# EAGLE schematic board_rev3 (EAGLE 4.16)
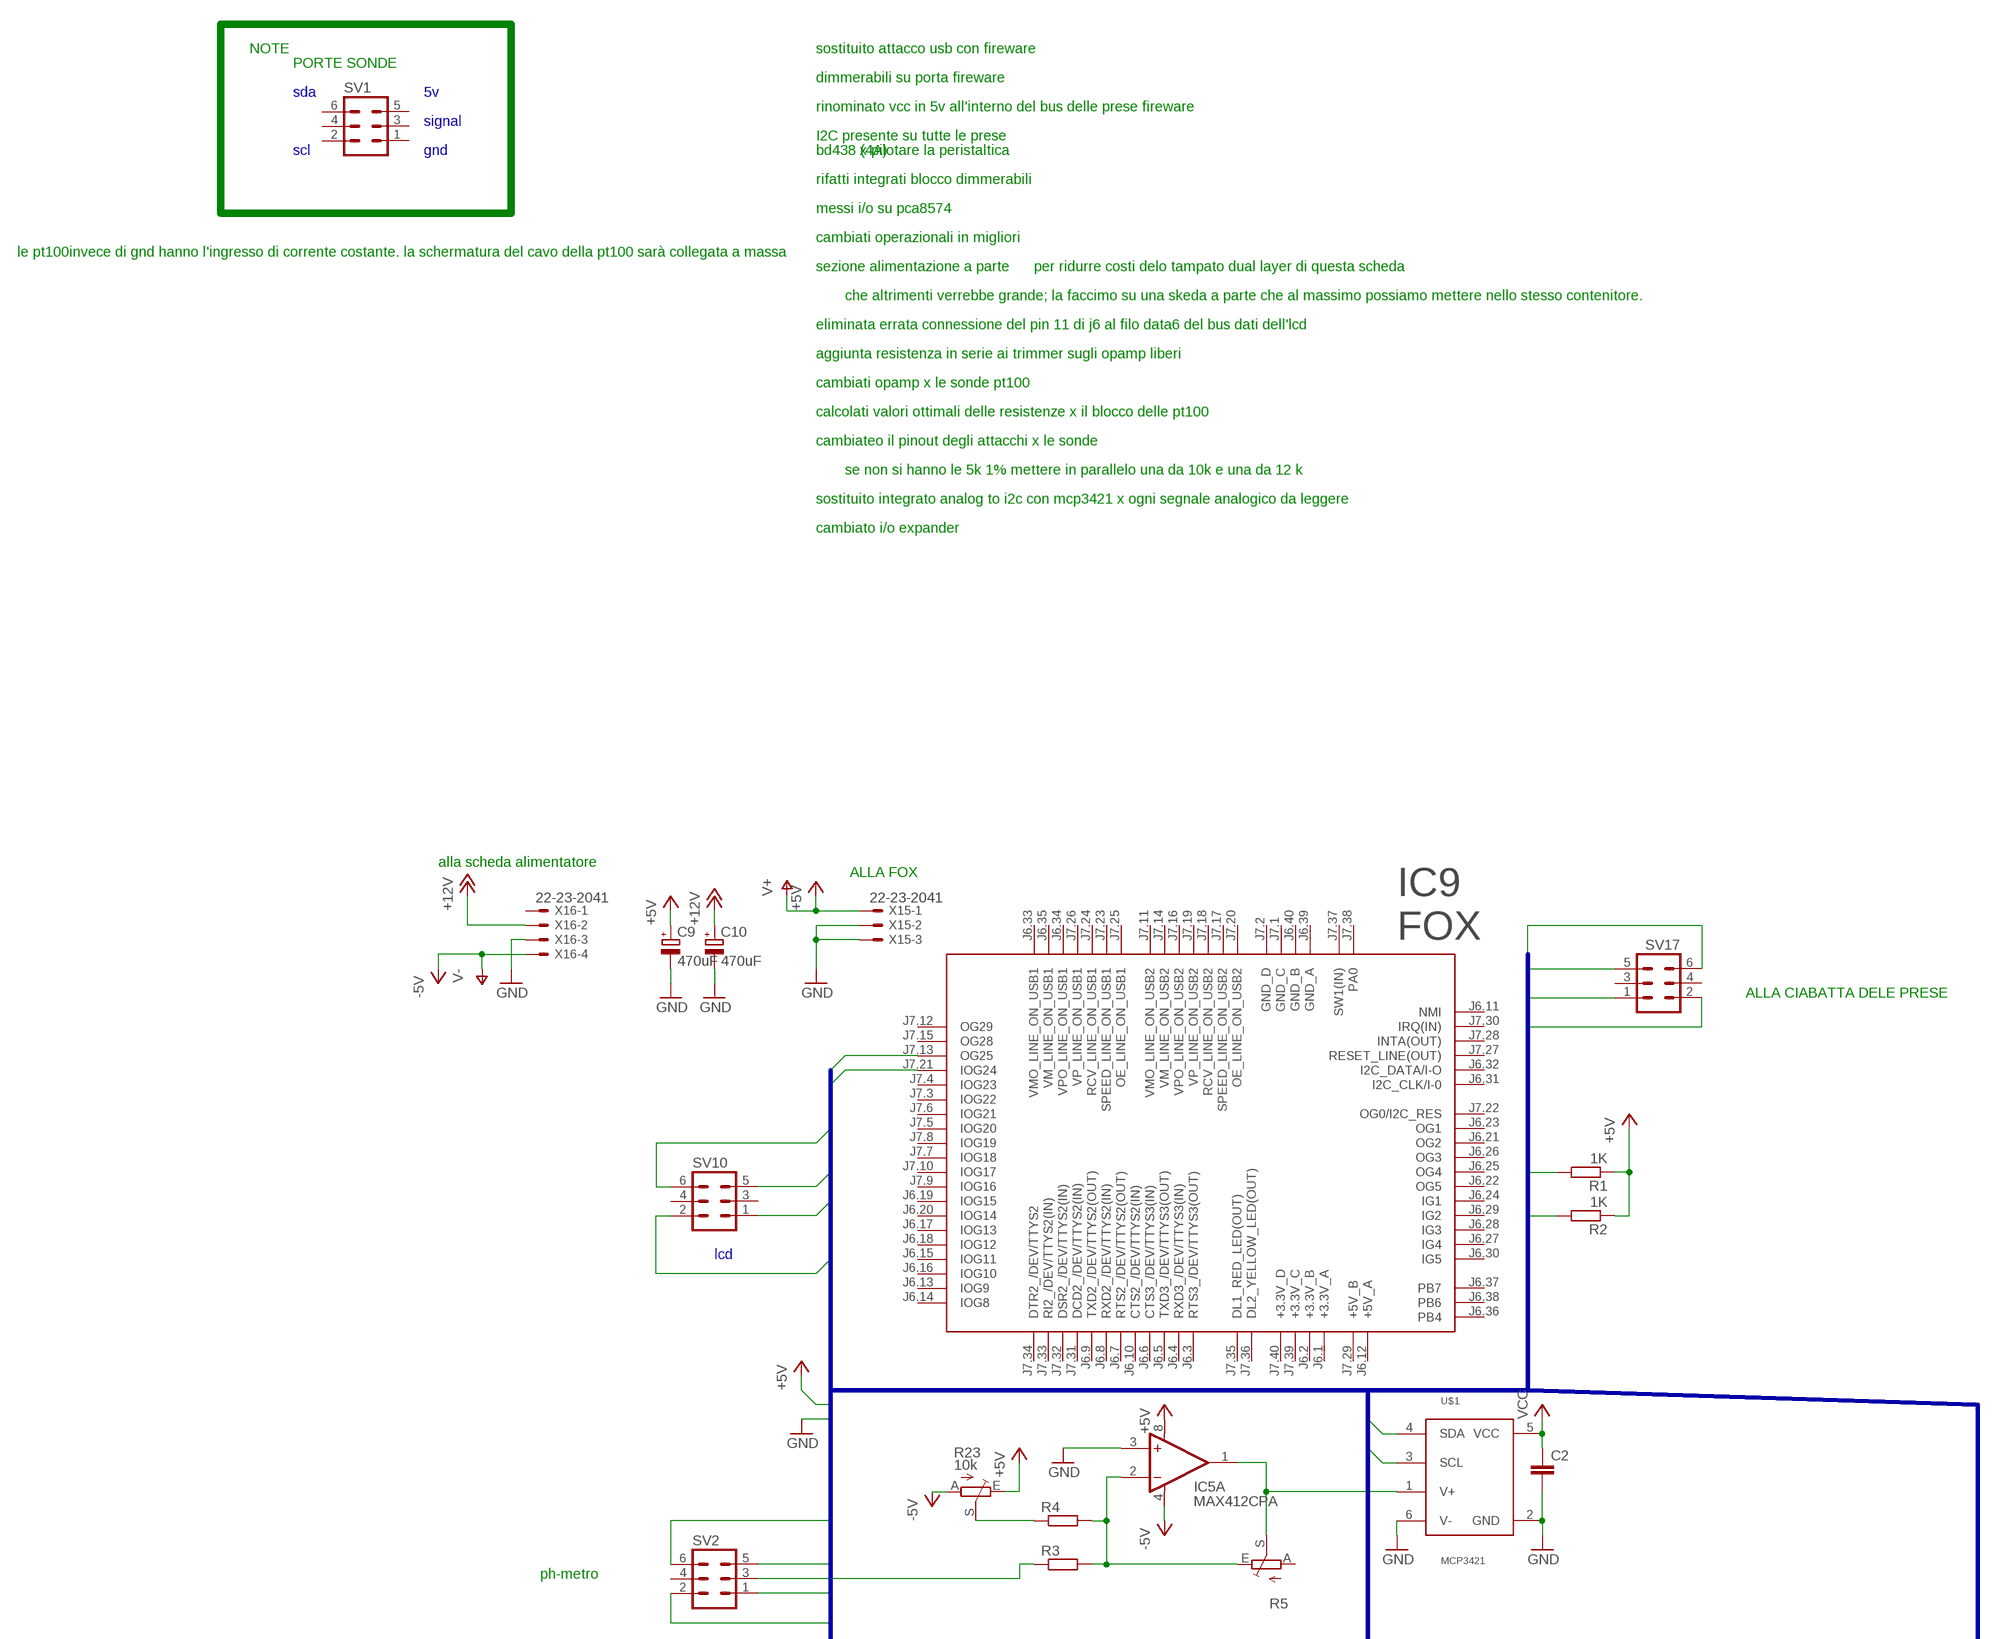
[diagram p0: schematic, sheet 1, part 1 of 2]
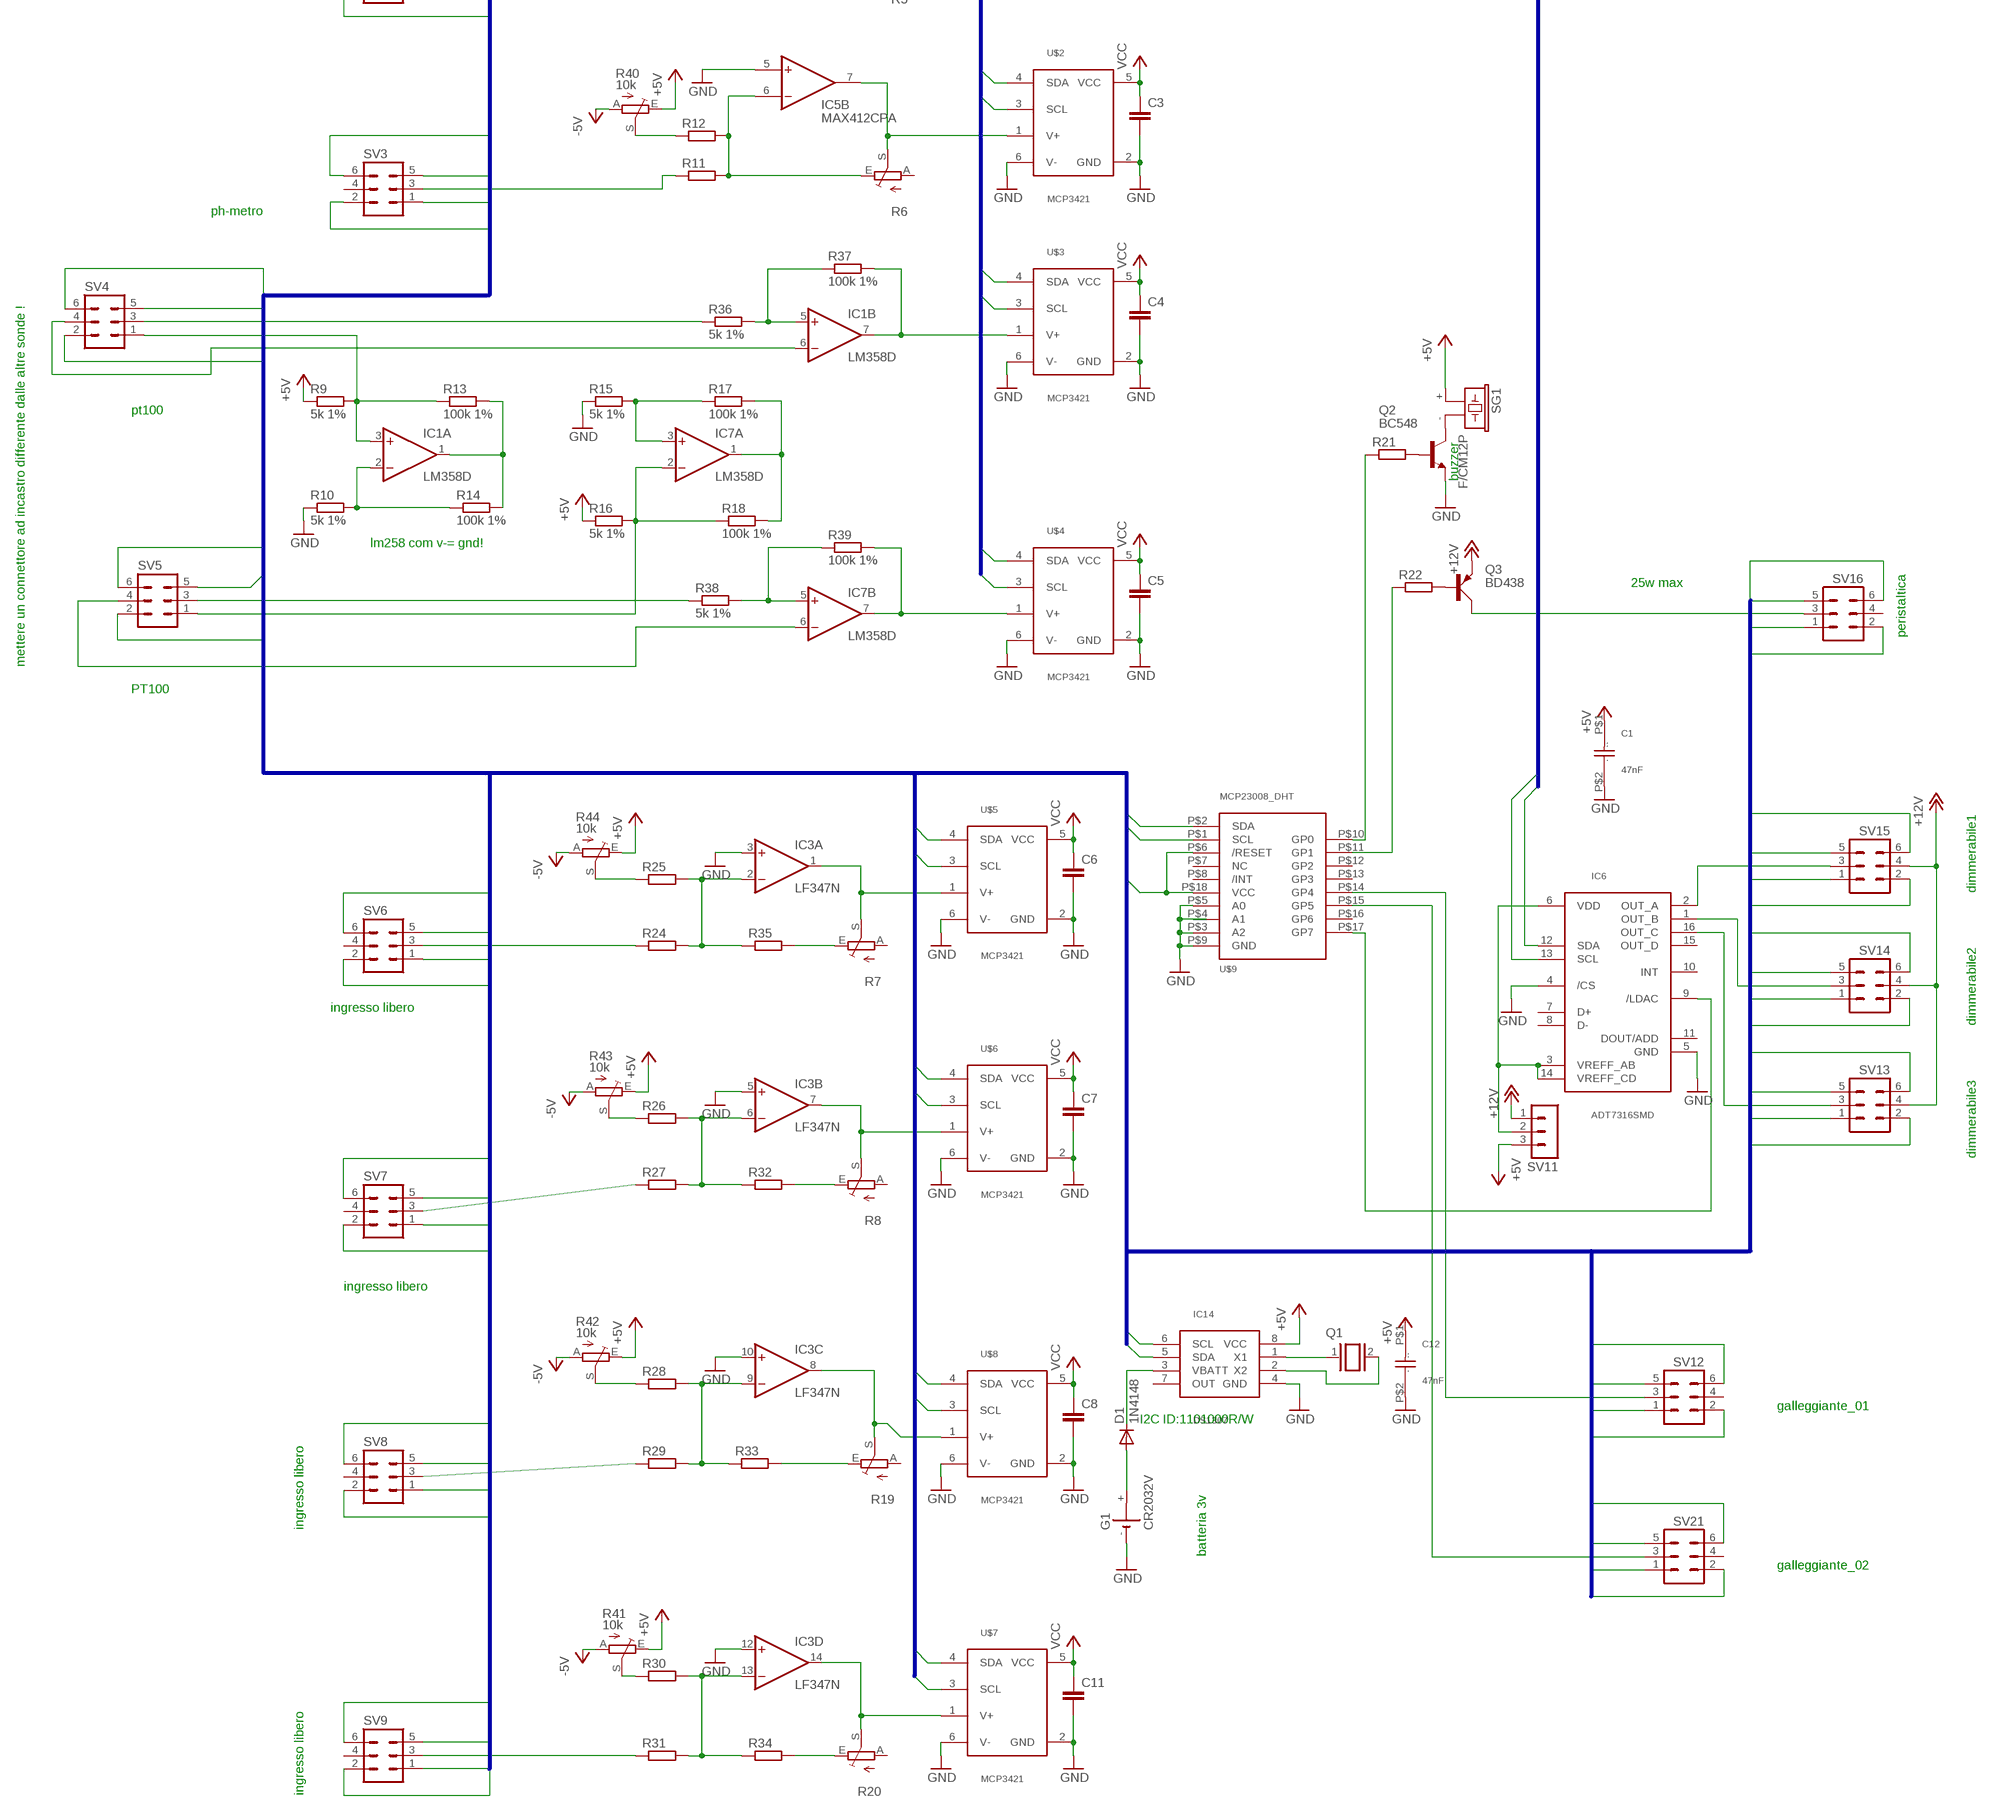
[diagram p1: schematic, sheet 1, part 2 of 2]

## Parts
C1  47nF  CAP_POLI  [CAP_POLI]
C2  C-EUC0805  [C0805]
C3  C-EUC0805  [C0805]
C4  C-EUC0805  [C0805]
C5  C-EUC0805  [C0805]
C6  C-EUC0805  [C0805]
C7  C-EUC0805  [C0805]
C8  C-EUC0805  [C0805]
C9  470uF  CPOL-EUE5-10.5  [E5-10,5]
C10  470uF  CPOL-EUE5-10.5  [E5-10,5]
C11  C-EUC0805  [C0805]
C12  47nF  CAP_POLI  [CAP_POLI]
D1  1N4148  [DO35-10]
G1  CR2032V  [CR2032V]
IC1  LM358D  [SO08]
IC3  LF347N  [DIL14]
IC5  MAX412CPA  [DIL08]
IC6  ADT7316SMD  [ADT7318SMD]
IC7  LM358D  [SO08]
IC9  FOX  [FOX]
IC14  DS1307  [DS1307]
Q1  XTAL  [Q]
Q2  BC548  [TO92-EBC]
Q3  BD438  [TO126AV]
R1  1K  R-EU_0207/10  [0207/10]
R2  1K  R-EU_0207/10  [0207/10]
R3  R-EU_0207/10  [0207/10]
R4  R-EU_0207/10  [0207/10]
R5  TRIM_EU-LI10  [LI10]
R6  TRIM_EU-LI10  [LI10]
R7  TRIM_EU-LI10  [LI10]
R8  TRIM_EU-LI10  [LI10]
R9  5k 1%  R-EU_0207/10  [0207/10]
R10  5k 1%  R-EU_0207/10  [0207/10]
R11  R-EU_0207/10  [0207/10]
R12  R-EU_0207/10  [0207/10]
R13  100k 1%  R-EU_0207/10  [0207/10]
R14  100k 1%  R-EU_0207/10  [0207/10]
R15  5k 1%  R-EU_0207/10  [0207/10]
R16  5k 1%  R-EU_0207/10  [0207/10]
R17  100k 1%  R-EU_0207/10  [0207/10]
R18  100k 1%  R-EU_0207/10  [0207/10]
R19  TRIM_EU-LI10  [LI10]
R20  TRIM_EU-LI10  [LI10]
R21  R-EU_0207/10  [0207/10]
R22  R-EU_0207/10  [0207/10]
R23  10k  TRIM_EU-LI10  [LI10]
R24  R-EU_0207/10  [0207/10]
R25  R-EU_0207/10  [0207/10]
R26  R-EU_0207/10  [0207/10]
R27  R-EU_0207/10  [0207/10]
R28  R-EU_0207/10  [0207/10]
R29  R-EU_0207/10  [0207/10]
R30  R-EU_0207/10  [0207/10]
R31  R-EU_0207/10  [0207/10]
R32  R-EU_0411/3V  [0411V]
R33  R-EU_0411/3V  [0411V]
R34  R-EU_0411/3V  [0411V]
R35  R-EU_0411/3V  [0411V]
R36  5k 1%  R-EU_0411/15  [0411/15]
R37  100k 1%  R-EU_0411/15  [0411/15]
R38  5k 1%  R-EU_0411/15  [0411/15]
R39  100k 1%  R-EU_0411/15  [0411/15]
R40  10k  TRIM_EU-LI10  [LI10]
R41  10k  TRIM_EU-LI10  [LI10]
R42  10k  TRIM_EU-LI10  [LI10]
R43  10k  TRIM_EU-LI10  [LI10]
R44  10k  TRIM_EU-LI10  [LI10]
SG1  F/CM12P  [F/CM12P]
SV1  MA03-2  [MA03-2]
SV2  MA03-2  [MA03-2]
SV3  MA03-2  [MA03-2]
SV4  MA03-2  [MA03-2]
SV5  MA03-2  [MA03-2]
SV6  MA03-2  [MA03-2]
SV7  MA03-2  [MA03-2]
SV8  MA03-2  [MA03-2]
SV9  MA03-2  [MA03-2]
SV10  MA03-2  [MA03-2]
SV11  MA03-1  [MA03-1]
SV12  MA03-2  [MA03-2]
SV13  MA03-2  [MA03-2]
SV14  MA03-2  [MA03-2]
SV15  MA03-2  [MA03-2]
SV16  MA03-2  [MA03-2]
SV17  MA03-2  [MA03-2]
SV21  MA03-2  [MA03-2]
U$1  MCP3421  [MCP3421]
U$2  MCP3421  [MCP3421]
U$3  MCP3421  [MCP3421]
U$4  MCP3421  [MCP3421]
U$5  MCP3421  [MCP3421]
U$6  MCP3421  [MCP3421]
U$7  MCP3421  [MCP3421]
U$8  MCP3421  [MCP3421]
U$9  MCP23008_DHT  [MCP23008_DHT]
X15  22-23-2041  [22-23-2041]
X16  22-23-2041  [22-23-2041]

## Nets
5V: IC1.6(B:-IN) SV2.5 SV3.5 SV4.4 SV4.5 SV5.5 SV6.5 SV7.5 SV8.5 SV9.5 SV10.5 SV12.5 SV13.5 SV14.5 SV15.5 SV16.5 SV17.5 SV21.5 U$9.P$6(/RESET) U$9.P$18(VCC) ; supply symbol labelled +5V
+5V: C1.P$1(.) C9.+ C12.P$1(.) IC14.8(VCC) R1.1 R2.1 R9.1 R16.1 R23.E R40.E R41.E R42.E R43.E R44.E SG1.+ SV11.3 X15.1 ; supply symbol labelled V+
+12V: C10.+ Q3.E SV11.1 SV13.4 SV14.4 SV15.4 X16.2
-5V: R23.A R40.A R41.A R42.A R43.A R44.A
CH0: IC3.14(D:OUT) R20.S U$7.1(V+)
CH1: IC3.8(C:OUT) R19.S U$8.1(V+)
CH2: IC3.7(B:OUT) R8.S U$6.1(V+)
CH3: IC3.1(A:OUT) R7.S U$5.1(V+)
GND: C1.P$2(..) C2.2 C3.2 C4.2 C5.2 C6.2 C7.2 C8.2 C9.- C10.- C11.2 C12.P$2(..) G1.- IC3.3(A:+IN) IC3.5(B:+IN) IC3.10(C:+IN) IC3.12(D:+IN) IC5.3(A:+IN) IC5.5(B:+IN) IC6.4(/CS) IC6.5(GND) IC14.4(GND) Q2.E R10.1 R15.1 SV2.1 SV3.1 SV6.1 SV7.1 SV8.1 SV9.1 SV10.1 SV12.1 SV13.1 SV14.1 SV15.1 SV16.1 SV17.1 SV21.1 U$1.2(GND) U$1.6(V-) U$2.2(GND) U$2.6(V-) U$3.2(GND) U$3.6(V-) U$4.2(GND) U$4.6(V-) U$5.2(GND) U$5.6(V-) U$6.2(GND) U$6.6(V-) U$7.2(GND) U$7.6(V-) U$8.2(GND) U$8.6(V-) U$9.P$3(A2) U$9.P$5(A0) U$9.P$9(GND) X15.2 X15.3 X16.3
N$1: R21.1 U$9.P$10(GP0)
N$2: IC1.1(A:OUT) R13.2 R14.2
N$3: IC7.1(A:OUT) R17.2 R18.2
N$4: D1.C IC14.3(VBATT)
N$5: IC7.5(B:+IN) R38.2 R39.1
N$6: IC1.5(B:+IN) R36.2 R37.1
N$7: IC7.6(B:-IN) SV5.4
N$8: IC1.2(A:-IN) R10.2 R14.1
N$9: IC5.1(A:OUT) R5.S U$1.1(V+)
N$10: IC5.7(B:OUT) R6.S U$2.1(V+)
N$11: SV21.3 U$9.P$15(GP5)
N$12: D1.A G1.+
N$13: IC1.7(B:OUT) R37.2 U$3.1(V+)
N$14: Q3.B R22.2
N$15: IC6.1(OUT_B) SV14.3
N$16: R22.1 U$9.P$11(GP1)
N$17: IC6.16(OUT_C) SV13.3
N$18: SV12.3 U$9.P$14(GP4)
N$19: Q3.C SV16.3
N$20: Q2.C SG1.-
N$21: IC6.3(VREFF_AB) IC6.6(VDD) IC6.14(VREFF_CD) SV11.2
N$22: IC7.7(B:OUT) R39.2 U$4.1(V+)
N$23: IC6.2(OUT_A)
N$25: IC6.9(/LDAC) U$9.P$17(GP7)
N$26: Q2.B R21.2
N$28: IC7.3(A:+IN) R15.2 R17.1
N$29: IC1.3(A:+IN) R9.2 R13.1 SV4.1
N$30: R8.E R32.2
N$31: R12.1 R40.S
N$32: IC7.2(A:-IN) R16.2 R18.1 SV5.1
N$33: R19.E R33.2
N$34: R20.E R34.2
N$35: R7.E R35.2
N$37: R36.1 SV4.3
N$38: R38.1 SV5.3
N$58: IC5.2(A:-IN) R3.2 R4.2 R5.E
N$60: R3.1 SV2.3
N$62: R4.1 R23.S
N$63: IC5.6(B:-IN) R6.E R11.2 R12.2
N$69: R11.1 SV3.3
N$83: IC14.1(X1) Q1.1
N$84: IC14.2(X2) Q1.2
N$113: IC3.2(A:-IN) R24.2 R25.2 R35.1
N$114: IC3.6(B:-IN) R26.2 R27.2 R32.1
N$115: IC3.9(C:-IN) R28.2 R29.2 R33.1
N$116: IC3.13(D:-IN) R30.2 R31.2 R34.1
N$117: R31.1 SV9.3
N$119: R29.1 SV8.3
N$121: R30.1 R41.S
N$122: R28.1 R42.S
N$123: R26.1 R43.S
N$124: R27.1 SV7.3
N$125: R24.1
N$126: R25.1 R44.S
SCL: IC6.13(SCL) IC9.J7.13(OG25) IC14.6(SCL) R2.2 SV2.2 SV3.2 SV4.2 SV5.2 SV6.2 SV7.2 SV8.2 SV9.2 SV10.2 SV12.2 SV13.2 SV14.2 SV15.2 SV16.2 SV17.2 SV21.2 U$1.3(SCL) U$2.3(SCL) U$3.3(SCL) U$4.3(SCL) U$5.3(SCL) U$6.3(SCL) U$7.3(SCL) U$8.3(SCL) U$9.P$1(SCL)
SDA: IC6.12(SDA) IC9.J7.21(IOG24) IC14.5(SDA) R1.2 SV2.6 SV3.6 SV4.6 SV5.6 SV6.6 SV7.6 SV8.6 SV9.6 SV10.6 SV12.6 SV13.6 SV14.6 SV15.6 SV16.6 SV17.6 SV21.6 U$1.4(SDA) U$2.4(SDA) U$3.4(SDA) U$4.4(SDA) U$5.4(SDA) U$6.4(SDA) U$7.4(SDA) U$8.4(SDA) U$9.P$2(SDA)
V-: X16.4 ; supply symbol labelled -5V
VCC: C2.1 C3.1 C4.1 C5.1 C6.1 C7.1 C8.1 C11.1 U$1.5(VCC) U$2.5(VCC) U$3.5(VCC) U$4.5(VCC) U$5.5(VCC) U$6.5(VCC) U$7.5(VCC) U$8.5(VCC)
Unconnected: G1.+@1(+) IC6.7(D+) IC6.8(D-) IC6.10(INT) IC6.11(DOUT/ADD) IC6.15(OUT_D) IC9.J6.1(+3.3V_A) IC9.J6.2(+3.3V_B) IC9.J6.3(RTS3_/DEV/TTYS3(OUT)) IC9.J6.4(RXD3_/DEV/TTYS3(IN)) IC9.J6.5(TXD3_/DEV/TTYS3(OUT)) IC9.J6.6(CTS3_/DEV/TTYS3(IN)) IC9.J6.7(RTS2_/DEV/TTYS2(OUT)) IC9.J6.8(RXD2_/DEV/TTYS2(IN)) IC9.J6.9(TXD2_/DEV/TTYS2(OUT)) IC9.J6.10(CTS2_/DEV/TTYS2(IN)) IC9.J6.11(NMI) IC9.J6.12(+5V_A) IC9.J6.13(IOG9) IC9.J6.14(IOG8) IC9.J6.15(IOG11) IC9.J6.16(IOG10) IC9.J6.17(IOG13) IC9.J6.18(IOG12) IC9.J6.19(IOG15) IC9.J6.20(IOG14) IC9.J6.21(OG2) IC9.J6.22(OG5) IC9.J6.23(OG1) IC9.J6.24(IG1) IC9.J6.25(OG4) IC9.J6.26(OG3) IC9.J6.27(IG4) IC9.J6.28(IG3) IC9.J6.29(IG2) IC9.J6.30(IG5) IC9.J6.31(I2C_CLK/I-0) IC9.J6.32(I2C_DATA/I-O) IC9.J6.33(VMO_LINE_ON_USB1) IC9.J6.34(VPO_LINE_ON_USB1) IC9.J6.35(VM_LINE_ON_USB1) IC9.J6.36(PB4) IC9.J6.37(PB7) IC9.J6.38(PB6) IC9.J6.39(GND_A) IC9.J6.40(GND_B) IC9.J7.1(GND_C) IC9.J7.2(GND_D) IC9.J7.3(IOG22) IC9.J7.4(IOG23) IC9.J7.5(IOG20) IC9.J7.6(IOG21) IC9.J7.7(IOG18) IC9.J7.8(IOG19) IC9.J7.9(IOG16) IC9.J7.10(IOG17) IC9.J7.11(VMO_LINE_ON_USB2) IC9.J7.12(OG29) IC9.J7.14(VM_LINE_ON_USB2) IC9.J7.15(OG28) IC9.J7.16(VPO_LINE_ON_USB2) IC9.J7.17(SPEED_LINE_ON_USB2) IC9.J7.18(RCV_LINE_ON_USB2) IC9.J7.19(VP_LINE_ON_USB2) IC9.J7.20(OE_LINE_ON_USB2) IC9.J7.22(OG0/I2C_RES) IC9.J7.23(SPEED_LINE_ON_USB1) IC9.J7.24(RCV_LINE_ON_USB1) IC9.J7.25(OE_LINE_ON_USB1) IC9.J7.26(VP_LINE_ON_USB1) IC9.J7.27(RESET_LINE(OUT)) IC9.J7.28(INTA(OUT)) IC9.J7.29(+5V_B) IC9.J7.30(IRQ(IN)) IC9.J7.31(DCD2_/DEV/TTYS2(IN)) IC9.J7.32(DSR2_/DEV/TTYS2(IN)) IC9.J7.33(RI2_/DEV/TTYS2(IN)) IC9.J7.34(DTR2_/DEV/TTYS2) IC9.J7.35(DL1_RED_LED(OUT)) IC9.J7.36(DL2_YELLOW_LED(OUT)) IC9.J7.37(SW1(IN)) IC9.J7.38(PA0) IC9.J7.39(+3.3V_C) IC9.J7.40(+3.3V_D) IC14.7(OUT) R5.A R6.A R7.A R8.A R19.A R20.A SV1.1 SV1.2 SV1.3 SV1.4 SV1.5 SV1.6 SV2.4 SV3.4 SV6.3 SV6.4 SV7.4 SV8.4 SV9.4 SV10.3 SV10.4 SV12.4 SV15.3 SV16.4 SV17.3 SV17.4 SV21.4 U$9.P$4(A1) U$9.P$7(NC) U$9.P$8(/INT) U$9.P$12(GP2) U$9.P$13(GP3) U$9.P$16(GP6) X15.4 X16.1

## Buses
BUS:SDA,SCL,GND,5V

## Notes on the sheet
- NOTE | sostituito attacco usb con fireware
- PORTE SONDE
- dimmerabili su porta fireware
- sda | 5v
- rinominato vcc in 5v all'interno del bus delle prese fireware
- signal
- I2C presente su tutte le prese
- scl | gnd | bd438 (4A) | x pilotare la peristaltica
- rifatti integrati blocco dimmerabili
- messi i/o su pca8574
- cambiati operazionali in migliori
- le pt100invece di gnd hanno l'ingresso di corrente costante. la schermatura del cavo della pt100 sarà collegata a massa
- sezione alimentazione a parte | per ridurre costi delo tampato dual layer di questa scheda
- che altrimenti verrebbe grande; la faccimo su una skeda a parte che al massimo possiamo mettere nello stesso contenitore.
- eliminata errata connessione del pin 11 di j6 al filo data6 del bus dati dell'lcd
- aggiunta resistenza in serie ai trimmer sugli opamp liberi
- cambiati opamp x le sonde pt100
- calcolati valori ottimali delle resistenze x il blocco delle pt100
- cambiateo il pinout degli attacchi x le sonde
- se non si hanno le 5k 1% mettere in parallelo una da 10k e una da 12 k
- sostituito integrato analog to i2c con mcp3421 x ogni segnale analogico da leggere
- cambiato i/o expander
- alla scheda alimentatore | ALLA FOX
- ALLA CIABATTA DELE PRESE
- lcd
- ph-metro
- ph-metro
- pt100
- buzzer
- lm258 com v-= gnd!
- peristaltica
- 25w max
- mettere un connettore ad incastro differente dalle altre sonde !
- PT100
- dimmerabile1
- ingresso libero
- dimmerabile2
- dimmerabile3
- ingresso libero
- galleggiante_01
- I2C ID:1101000R/W
- ingresso libero
- batteria 3v
- galleggiante_02
- ingresso libero

## Power pins joined to a net without a drawn wire
V+: IC1.8(P:V+) IC3.4(P:V+) IC5.8(A:V+) IC7.8(P:V+)
V-: IC1.4(P:V-) IC3.11(P:V-) IC5.4(A:V-) IC7.4(P:V-)

## Library data of the parts
C1 C12 = aggiunte:CAP_POLI: Condensatore non elett passo 5.08 mm (2 x 2.54)
C2-C8 C11 = rcl:C-EU: CAPACITOR, European symbol
C9 C10 = rcl:CPOL-EU: POLARIZED CAPACITOR, European symbol
D1 = diode:1N4148: DIODE high speed (Philips)
G1 = battery:CR2032V: LI BATTERY Varta
IC1 IC7 = linear:LM358: OP AMP also LM158; LM258; LM2904 Source: http://cache.national.com/ds/LM/LM158.pdf
IC3 = linear:LF347: OP AMP
IC5 = maxim:MAX412CPA: OP AMP
IC6 = aggiunte:ADT7316SMD: ADT7318 smd I2C DAC 4 Ch
IC9 = aggiunte:FOX: FOXBOARD Un sistema linux embedded completo www.acmesystem.it
IC14 = aggiunte:DS1307: DS1307 calendario e orologio I2C
Q1 = special:XTAL: CRYSTAL
Q2 = transistor-npn:BC548*: NPN Transistor
Q3 = transistor-power:BD438: PNP TRANSISTOR
R1-R4 R9-R18 R21 R22 R24-R39 = rcl:R-EU_: RESISTOR, European symbol
R5-R8 R19 R20 R23 R40-R44 = pot:TRIM_EU-: POTENTIOMETER
SG1 = buzzer:F/CM12P: BUZZER Source: Buerklin
SV1-SV10 SV12-SV17 SV21 = con-lstb:MA03-2: PIN HEADER
SV11 = con-lstb:MA03-1: PIN HEADER
U$1-U$8 = aggiunte:MCP3421: MCP3421 differential analog to i2c @ 12/14/18bit
U$9 = aggiunte:MCP23008_DHT: MCP23008 I2C EXPANDER 8 Ch
X15 X16 = con-molex:22-23-2041: .100" (2.54mm) Center Header - 4 Pin

## Net classes
0 default: width 0.61 mm